# EAGLE design IMU_v2_module (EAGLE 6.4)
REV: 5.0
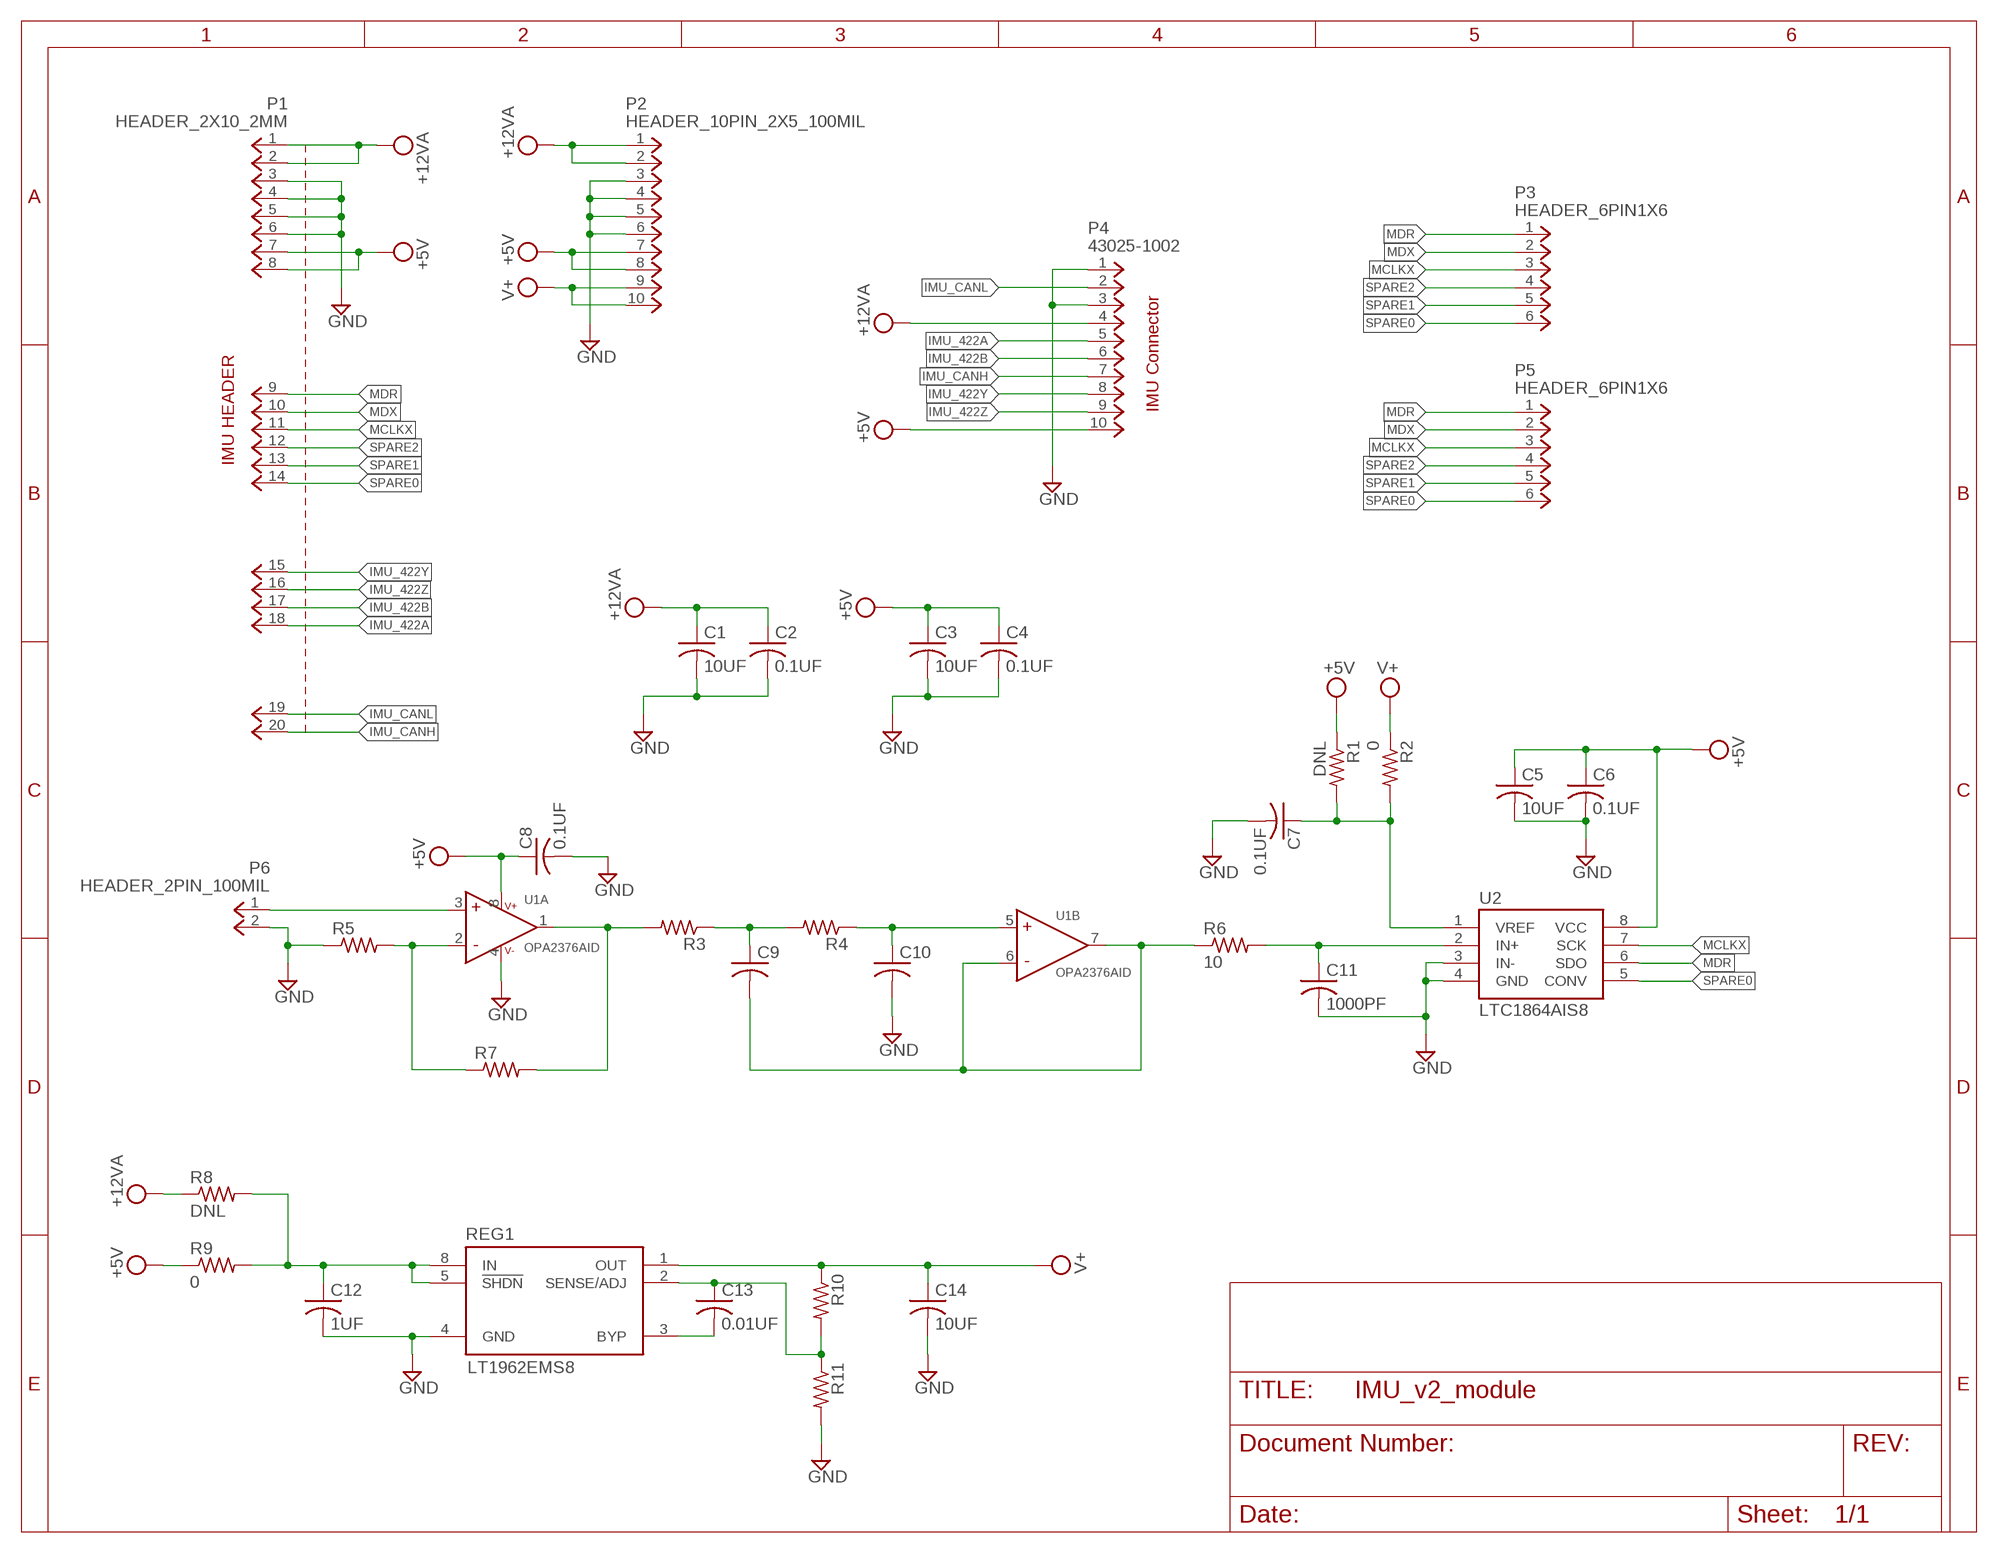
[diagram p0: schematic, sheet 1]

## Parts
C1  10UF  C-USC1206K  [C1206K]
C2  0.1UF  C-USC0603K  [C0603K]
C3  10UF  C-USC1206K  [C1206K]
C4  0.1UF  C-USC0603K  [C0603K]
C5  10UF  C-USC1206  [C1206]
C6  0.1UF  C-USC0603K  [C0603K]
C7  0.1UF  C-USC0603K  [C0603K]
C8  0.1UF  C-USC0603K  [C0603K]
C9  C-USC0603K  [C0603K]
C10  C-USC0603K  [C0603K]
C11  1000PF  C-USC0603K  [C0603K]
C12  1UF  C-USC0603K  [C0603K]
C13  0.01UF  C-USC0603K  [C0603K]
C14  10UF  C-USC1206K  [C1206K]
P1  HEADER_2X10_2MM  [HEADER_2X10_2MM]
P2  HEADER_10PIN_2X5_100MIL  [HEADER_2X5]
P3  HEADER_6PIN1X6  [HEADER_1X6]
P4  43025-1002  [MICRO-FIT_10RA]
P5  HEADER_6PIN1X6  [HEADER_1X6]
P6  HEADER_2PIN_100MIL  [HEADER_1X2]
R1  DNL  R-US_R0603  [R0603]
R2  0  R-US_R0603  [R0603]
R3  R-US_R0603  [R0603]
R4  R-US_R0603  [R0603]
R5  R-US_R0603  [R0603]
R6  10  R-US_R0603  [R0603]
R7  R-US_R0603  [R0603]
R8  DNL  R-US_R0603  [R0603]
R9  0  R-US_R0603  [R0603]
R10  R-US_R0603  [R0603]
R11  R-US_R0603  [R0603]
REG1  LT1962EMS8  [MSOP8]
U1  OPA2376AID  [SOIC8]
U2  LTC1864AIS8  [SOIC8]

## Nets
+5V: C3.1 C4.1 C5.1 C6.1 C8.1 P1.7 P1.8 P2.7 P2.8 P4.10 R1.1 R9.1 U1.8(A:V+) U2.8(VCC)
+12VA: C1.1 C2.1 P1.1 P1.2 P2.1 P2.2 P4.4 R8.1
GND: C1.2 C2.2 C3.2 C4.2 C5.2 C6.2 C7.2 C8.2 C10.2 C11.2 C12.2 C14.2 P1.3 P1.4 P1.5 P1.6 P2.3 P2.4 P2.5 P2.6 P4.1 P4.3 P6.2 R5.1 R11.2 REG1.4(GND) U1.4(A:V-) U2.3(IN-) U2.4(GND)
IMU_422A: P1.18 P4.5
IMU_422B: P1.17 P4.6
IMU_422Y: P1.15 P4.8
IMU_422Z: P1.16 P4.9
IMU_CANH: P1.20 P4.7
IMU_CANL: P1.19 P4.2
LC_A: C9.2 R6.1 U1.6(B:IN-) U1.7(B:OUT)
MCLKX: P1.11 P3.3 P5.3 U2.7(SCK)
MDR: P1.9 P3.1 P5.1 U2.6(SDO)
MDX: P1.10 P3.2 P5.2
N$1: C12.1 R8.2 R9.2 REG1.5(!SHDN) REG1.8(IN)
N$2: C7.1 R1.2 R2.2 U2.1(VREF)
N$3: R5.2 R7.1 U1.2(A:IN-)
N$4: P6.1 U1.3(A:IN+)
N$5: R3.2 R7.2 U1.1(A:OUT)
N$6: C11.1 R6.2 U2.2(IN+)
N$7: C9.1 R3.1 R4.2
N$8: C10.1 R4.1 U1.5(B:IN+)
N$65: C13.2 REG1.3(BYP)
N$66: C13.1 R10.2 R11.1 REG1.2(SENSE/ADJ)
SPARE0: P1.14 P3.6 P5.6 U2.5(CONV)
SPARE1: P1.13 P3.5 P5.5
SPARE2: P1.12 P3.4 P5.4
V+: C14.1 P2.9 P2.10 R2.1 R10.1 REG1.1(OUT)

## Notes on the sheet
- IMU Connector
- IMU HEADER

## Library data of the parts
C1-C14 = rcl:C-US: CAPACITOR, American symbol
P1 = connector:HEADER_2X10: 2 x 10 Pin Header
P2 = connector:HEADER_10PIN
P3 P5 = connector:HEADER_6PIN
P4 = connector:43025-10: Micro-Fit 3mm 10-pin connector.; VENDOR: Digikey; VENDOR_PN: WM1823-ND
P6 = connector:HEADER_2PIN: 2 PIN Jumper
R1-R11 = rcl:R-US_: RESISTOR, American symbol
REG1 = power_conversion:LT1*62: Linear Technologies 150 mA and 300 mA LDO regulators.; CURRENT: 300 mA; VENDOR: Digikey; VENDOR_PN: LT1962EMS8#PBF-ND
U1 = amplifiers:OPA2376: Dual R-R precision op-amp.; VENDOR: Digikey; VENDOR_PN: 296-22564-1-ND
U2 = data_conversion:LTC1864: LTC1864:µPower, 16-Bit, 250ksps 1-Channel ADC; VENDOR: Digikey; VENDOR_PN: LTC1864ACS8#PBF-ND

## Board
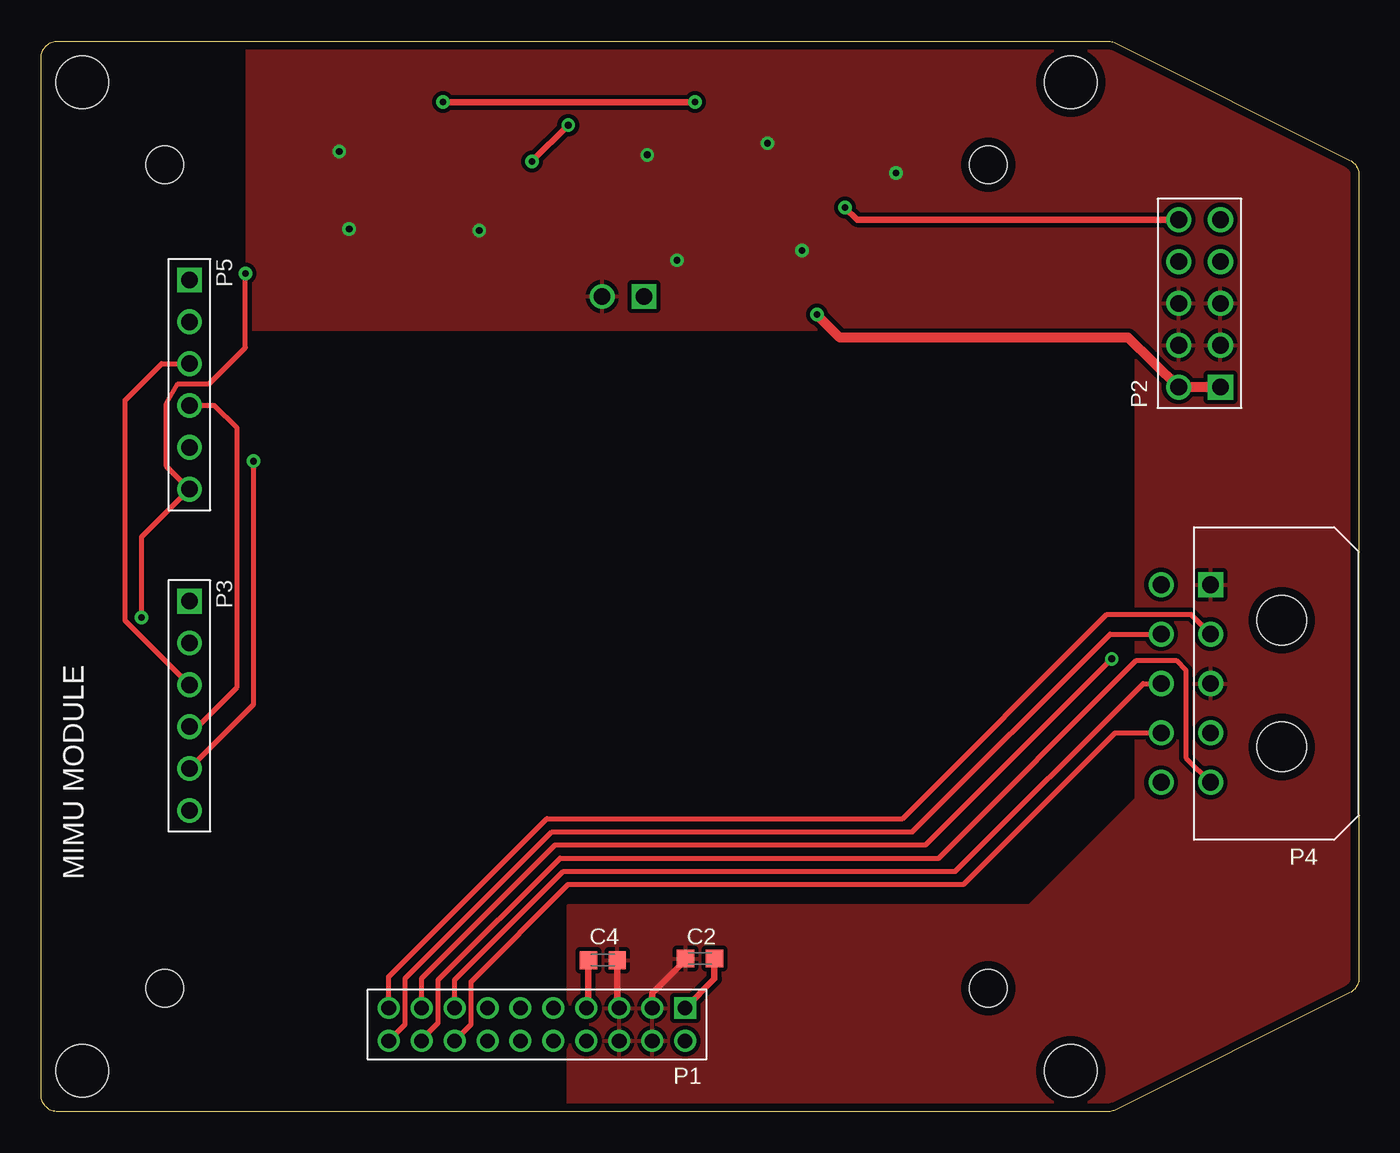
[diagram p1: board, top side]
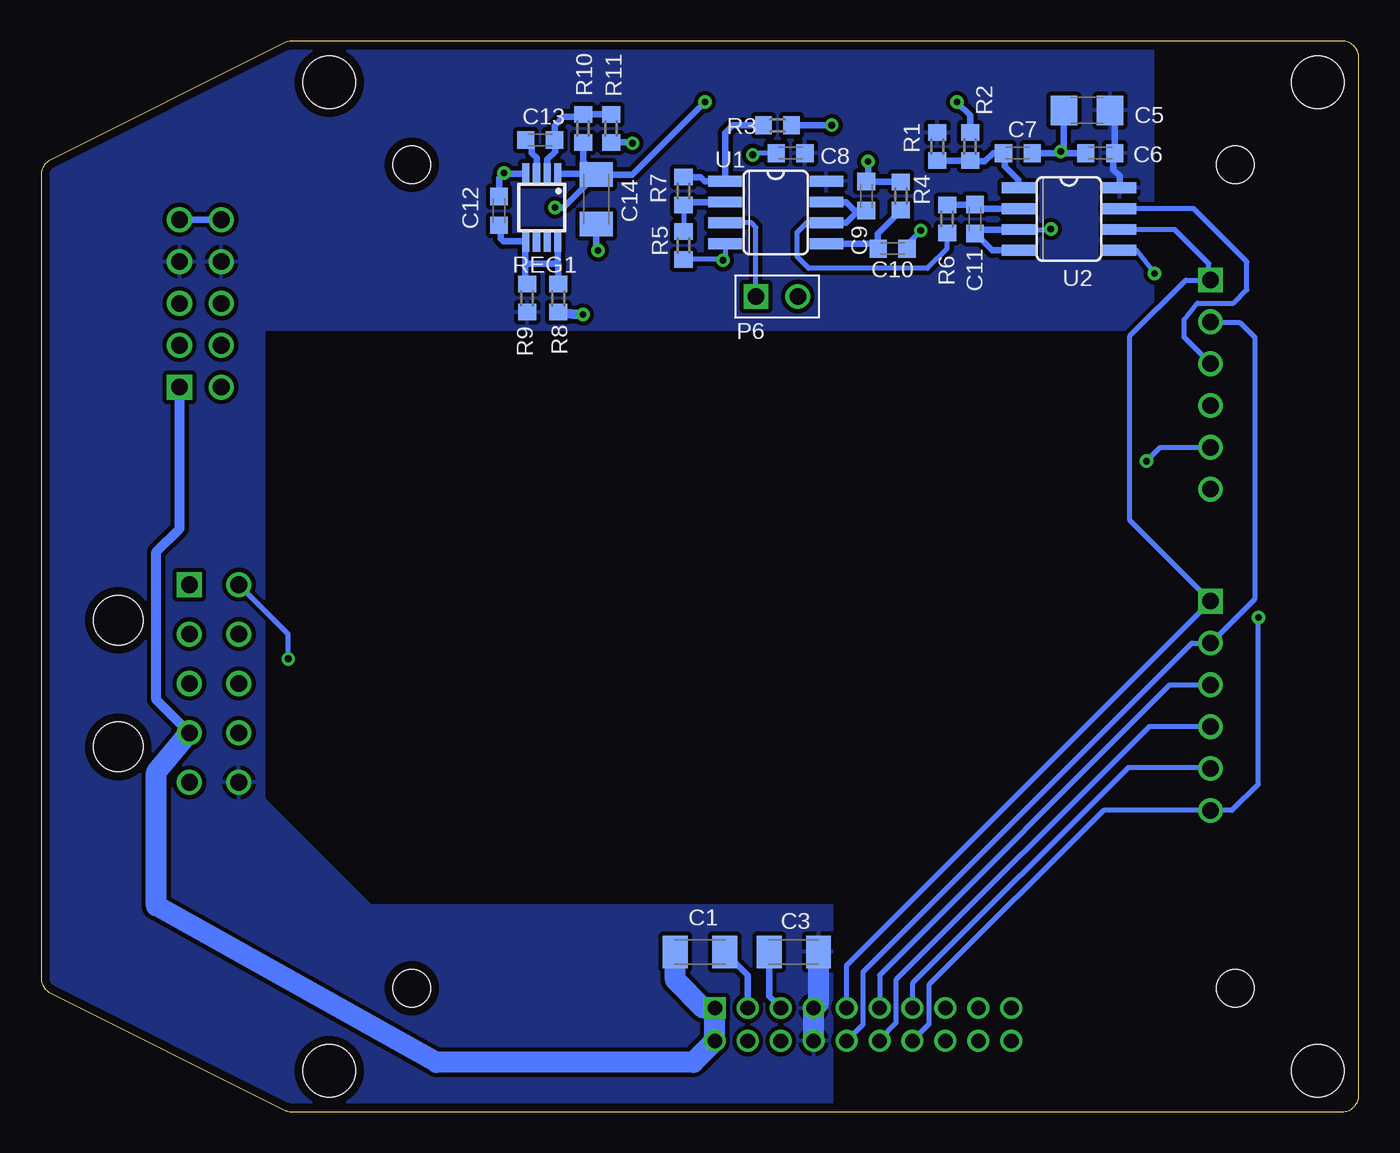
[diagram p2: board, bottom side, seen from below]

Size 80 x 65 mm. Coordinates in mm from the lower left corner, seen from the top.
Outline: 0,64 arc-90 1,65 64.76,65 arc-27 65.21,64.89 79.45,57.78 arc-63 80,56.88 80,8.12 arc-63 79.45,7.22 65.21,0.11 arc-27 64.76,0 1,0 arc-90 0,1 0,64
Copper layers (1*16): Top 0.0178mm / dielectric 59mil / Bottom 0.0178mm
Design rules "SSC-EAGLE-2Lyr_v1.0.0.3": minimum track width 6mil, minimum drill 14mil, track to track 6mil, track to pad 6mil, pad to pad 6mil, via to via 6mil, smd to smd 6mil, copper to edge 20mil, drill to drill 16mil, minimum pad ring 8mil, minimum via ring 8mil, stop-mask expansion 3mil, vias tented up to drill 0mil, thermal gap 10mil
Holes 2.26 mm at 7.5,57.5 57.5,57.5 57.5,7.5 7.5,7.5
Holes 3.17 mm at 2.5,62.5 2.5,2.5 62.5,2.5 62.5,62.5

### Footprints (pad centres in the part's own frame; a part is rotated, then mirrored left to right if it is on the bottom)
C1206K = smd 1.5 x 2: 1 -1.5,0; 2 1.5,0
C0603K = smd 1.05 x 1.08: 1 -0.875,0; 2 0.875,0
C1206 = smd 1.6 x 1.8: 1 -1.4,0; 2 1.4,0
HEADER_2X10_2MM = drill 0.889 square: 1 0,0 | drill 0.889: 2 0,2; 3 2,0; 4 2,2; 5 4,0; 6 4,2; 7 6,0; 8 6,2; 9 8,0; 10 8,2; 11 10,0; 12 10,2; 13 12,0; 14 12,2; 15 14,0; 16 14,2; 17 16,0; 18 16,2; 19 18,0; 20 18,2
HEADER_2X5 = drill 1.016 square: 1 0,0 | drill 1.016: 2 0,2.54; 3 2.54,0; 4 2.54,2.54; 5 5.08,0; 6 5.08,2.54; 7 7.62,0; 8 7.62,2.54; 9 10.16,0; 10 10.16,2.54
HEADER_1X6 = drill 1 square: 1 0,0 | drill 1: 2 2.54,0; 3 5.08,0; 4 7.62,0; 5 10.16,0; 6 12.7,0
MICRO-FIT_10RA = drill 1.016 square: 1 6,0 | drill 1.016: 2 3,0; 3 0,0; 4 -3,0; 5 -6,0; 6 6,3; 7 3,3; 8 0,3; 9 -3,3; 10 -6,3 | hole 3: -3.85,-4.32; 3.85,-4.32
HEADER_1X2 = drill 1 square: 1 0,0 | drill 1: 2 2.54,0
R0603 = smd 1 x 1.1: 1 -0.85,0; 2 0.85,0
MSOP8 = smd 0.432 x 1.27: 1 -0.975,-2.05; 2 -0.325,-2.05; 3 0.325,-2.05; 4 0.975,-2.05; 5 0.975,2.05; 6 0.325,2.05; 7 -0.325,2.05; 8 -0.975,2.05
SOIC8 = smd 0.66 x 2.032: 1 -1.905,-3.073; 2 -0.635,-3.073; 3 0.635,-3.073; 4 1.905,-3.073; 5 1.905,3.073; 6 0.635,3.073; 7 -0.635,3.073; 8 -1.905,3.073

### Placement (x,y rotation side)
C1  40,9.7 0 bottom
C2  40,9.3 180 top
C3  34.3,9.7 180 bottom
C4  34.1,9.2 0 top
C5  16.5,60.8 180 bottom
C6  15.7,58.2 180 bottom
C7  20.7,58.2 0 bottom
C8  34.5,58.2 180 bottom
C9  29.9,55.6 270 bottom
C10  28.3,52.4 0 bottom
C11  23.3,54.2 270 bottom
C12  52.2,54.7 90 bottom
C13  49.7,59 180 bottom
C14  46.3,55.4 270 bottom
P1  39.1,6.3 180 top
P2  71.6,44 90 top
P3  9,31 270 top
P4  71,26 90 top
P5  9,50.5 270 top
P6  36.6,49.5 0 bottom
R1  25.6,58.6 270 bottom
R2  23.6,58.6 270 bottom
R3  35.3,59.9 180 bottom
R4  27.8,55.6 90 bottom
R5  41,52.6 90 bottom
R6  25,54.2 90 bottom
R7  41,55.9 90 bottom
R8  48.6,49.4 90 bottom
R9  50.5,49.4 90 bottom
R10  47.1,59.7 90 bottom
R11  45.4,59.7 270 bottom
REG1  49.6,54.9 180 bottom
U1  35.4,54.6 270 bottom
U2  17.6,54.2 270 bottom

### Tracks (layer width: path | path; a pad name or v marks a point on that pad's centre or on a via)
+5V
  Top 0.406: C4.1 33.23,6.42 P1.7
  Bottom 0.406: U2.8 14.53,56.83 14.9,57.2 14.9,58.12 C6.1 14.82,60.52 C5.1
  Bottom 0.61: R9.1 50.55,48.5
  Bottom 1.27: P1.8 P1.7 32.8,6.6 C3.1
  pour Bottom (isolate 0.254): 32,0 32,12.5 60,12.5 66.5,19 66.5,47.5 12.5,47.5 12.5,65 65,65 80,57.5 80,7.5 65,0
+12VA  (via drill 0.41)
  Top 0.406: P1.1 40.88,8.07 C2.1
  Top 0.61: P2.1 P2.2 66,47 48.5,47 v47.1,48.4
  Bottom 0.61: v47.1,48.4 48.5,48.45 R8.1 | P2.1 71.6,35.4 73,34 73,25 P4.4
  Bottom 1.27: C1.1 41.5,8 39.8,6.3 P1.1 P1.2 40.4,3 56,3 73,12.5 73,20.6 P4.4
GND  (via drill 0.41)
  Top 0.305: 39.12,9.22 C2.2
  Top 0.406: C4.2 34.98,6.42 P1.5 | 39.12,9.22 37.1,7.2 P1.3
  Bottom 0.305: U2.3 18.73,53.56 v18.7,53.6 | C10.2 27.43,52.67 v26.6,53.5 | U1.4 38.47,51.83 v38.6,51.7 38.65,51.75 R5.1 | C8.2 36.7,58.2 v36.8,58.1 | 51.85,56.95 v51.9,57 | 44.15,58.85 v44.1,58.8
  Bottom 0.406: U2.3 23.06,53.56 C11.2 22.27,52.3 U2.4 | C5.2 17.9,58.5 v18.1,58.3 | C6.2 18,58.2 v18.1,58.3 | C7.2 18.2,58.2 v18.1,58.3 | C12.2 52.2,56.7 v51.9,57 | REG1.4 51.85,56.95 | C14.2 46.3,52.4 v46.2,52.3 | R11.2 44.15,58.85 | C3.2 35.8,7 P1.5 | C1.2 37.1,8.3 P1.3
  pour Top (isolate 0.254): 32,12.5 32,0 65,0 80,7.5 80,57.5 65,65 12.5,65 12.5,47.5 66.5,47.5 66.5,19 60,12.5
IMU_422A
  Top 0.305: P1.18 23.1,4.4 24.1,5.4 24.1,8 31.5,15.4 54.5,15.4 66.5,27.4 68.9,27.4 69.5,26.8 69.5,21.5 P4.5
IMU_422B  (via drill 0.41)
  Top 0.305: P1.17 23.1,8.1 31.2,16.2 53.7,16.2 v65,27.5
  Bottom 0.305: v65,27.5 65,29 P4.6
IMU_422Y
  Top 0.305: P1.15 25.1,8 31.7,14.6 55.5,14.6 66.9,26 P4.8
IMU_422Z
  Top 0.305: P1.16 26.1,5.3 26.1,7.9 32,13.8 56,13.8 65.2,23 P4.9
IMU_CANH
  Top 0.305: P1.20 22.1,5.3 22.1,8.1 31,17 52.9,17 64.9,29 P4.7
IMU_CANL
  Top 0.305: P1.19 21.1,8.2 30.7,17.8 52.3,17.8 64.7,30.2 69.8,30.2 P4.2
LC_A
  Bottom 0.305: R6.1 25,52.4 26.2,51.2 33.4,51.2 34.1,51.9 34.1,53.4 33.5,54 32.36,54 U1.6
  Bottom 0.406: U1.7 31.14,55.23 30.6,54.7 30.4,54.7 | 30.4,54.7 29.93,54.7 C9.2 29.9,54.6 | U1.6 31.14,53.97 30.4,54.7
MCLKX
  Top 0.305: P5.3 7.32,45.42 5.1,43.2 5.1,29.82 P3.3
  Bottom 0.305: P1.11 29.1,8.3 11.5,25.9 9.02,25.9 P3.3 | U2.7 10.04,54.84 6.8,51.6 6.8,49.9 7.6,49.1 9.8,49.1 10.6,48.1 10.6,47.02 P5.3
MDR
  Bottom 0.305: P1.9 31.1,8.9 P3.1 13.9,35.9 13.9,47.1 10.5,50.5 P5.1 | U2.6 11.16,53.56 9.1,51.5 9.1,50.6
  Bottom 0.406: P5.1 9.1,50.6
MDX
  Bottom 0.305: P1.10 30.1,5.3 30.1,8.5 10.14,28.46 P3.2 6.3,31.16 6.3,47 7.2,47.9 9,47.9 P5.2
N$1
  Bottom 0.305: 52.1,53.73 C12.1 | 48.6,51.5 48.62,51.52 | 50.6,52.83 REG1.5
  Bottom 0.406: REG1.5 51.95,52.85 52.1,53 52.1,53.73 | 48.62,51.52 REG1.8 | 50.6,51.5 48.6,51.5 R8.2 | 50.6,51.5 50.6,52.83 | R9.2 50.6,50.3 50.6,51.5
N$2
  Bottom 0.406: U2.1 20.67,56.57 21.5,57.4 21.5,58.12 C7.1 22.2,58.2 22.7,57.7 23.55,57.7 R2.2 R1.2
N$3
  Bottom 0.305: R7.1 R5.2
  Bottom 0.406: U1.2 41,55.23 R7.1
N$4
  Bottom 0.305: U1.3 36.87,53.97 36.6,53.7 P6.1
N$5
  Bottom 0.406: R7.2 39.95,56.75 39.7,56.5 U1.1 38.47,59.43 38,59.9 R3.2
N$6
  Bottom 0.406: U2.2 23.06,54.84 C11.1 24.77,55.08 R6.2
N$7  (via drill 0.41)
  Top 0.406: v29.8,57.7 v32,59.9
  Bottom 0.406: v32,59.9 R3.1 | v29.8,57.7 29.8,56.58 C9.1 27.82,56.48 R4.2
N$8
  Bottom 0.406: R4.1 27.8,54.7 29.2,53.3 29.2,52.42 C10.1 29.47,52.7 U1.5
N$65
  Bottom 0.406: REG1.3 49.92,57.92 50.2,58.2 50.2,58.62 C13.2
N$66
  Bottom 0.305: C13.1 48.8,58.98 | R10.2 47.25,60.4
  Bottom 0.406: REG1.2 49.27,57.83 48.8,58.3 48.8,58.98 | C13.1 48.83,59.88 48.3,60.4 47.25,60.4 | R11.1 R10.2
SPARE0  (via drill 0.41)
  Top 0.305: v6.1,30 6.1,34.9 P5.6 7.6,39.2 7.6,43 8.3,44.2 10.2,44.2 12.4,46.4 v12.4,50.9
  Bottom 0.305: P1.14 26.1,5.3 26.1,7.7 15.5,18.3 P3.6 7.7,18.3 6.1,19.9 v6.1,30 | U2.5 13.53,52.33 v12.4,50.9
SPARE1  (via drill 0.41)
  Top 0.305: v12.9,39.5 12.9,24.74 P3.5
  Bottom 0.305: P1.13 27.1,7.8 14,20.9 9.06,20.9 P3.5 | P5.5 12.06,40.34 v12.9,39.5
SPARE2
  Top 0.305: P5.4 10.52,42.88 11.9,41.5 11.9,25.78 9.5,23.38 P3.4
  Bottom 0.305: P1.12 29.1,4.4 28.1,5.4 28.1,8 12.72,23.38 P3.4
V+  (via drill 0.41)
  Top 0.406: v24.4,61.3 v39.7,61.3 | P2.10 49.54,54.16 v48.8,54.9
  Bottom 0.305: 47.1,57.7 47.1,56.95
  Bottom 0.406: R10.1 47.1,57.7 C14.1 | 47.1,56.95 REG1.1 | C14.1 44.1,56.9 v39.7,61.3 | v24.4,61.3 23.6,60.5 R2.1 | P2.10 P2.9 | v48.8,54.9 48.3,54.9 C14.1

### Text on the board
Top: Layer 1
Bottom: Layer 2
tPlace: MIMU MODULE